# EasyEDA schematic weather_station_project.json
TITLE: Sheet_1; REV: 1.0; Date: 2025-05-27; Sheet: 1/1; Company: Corentin VERNET
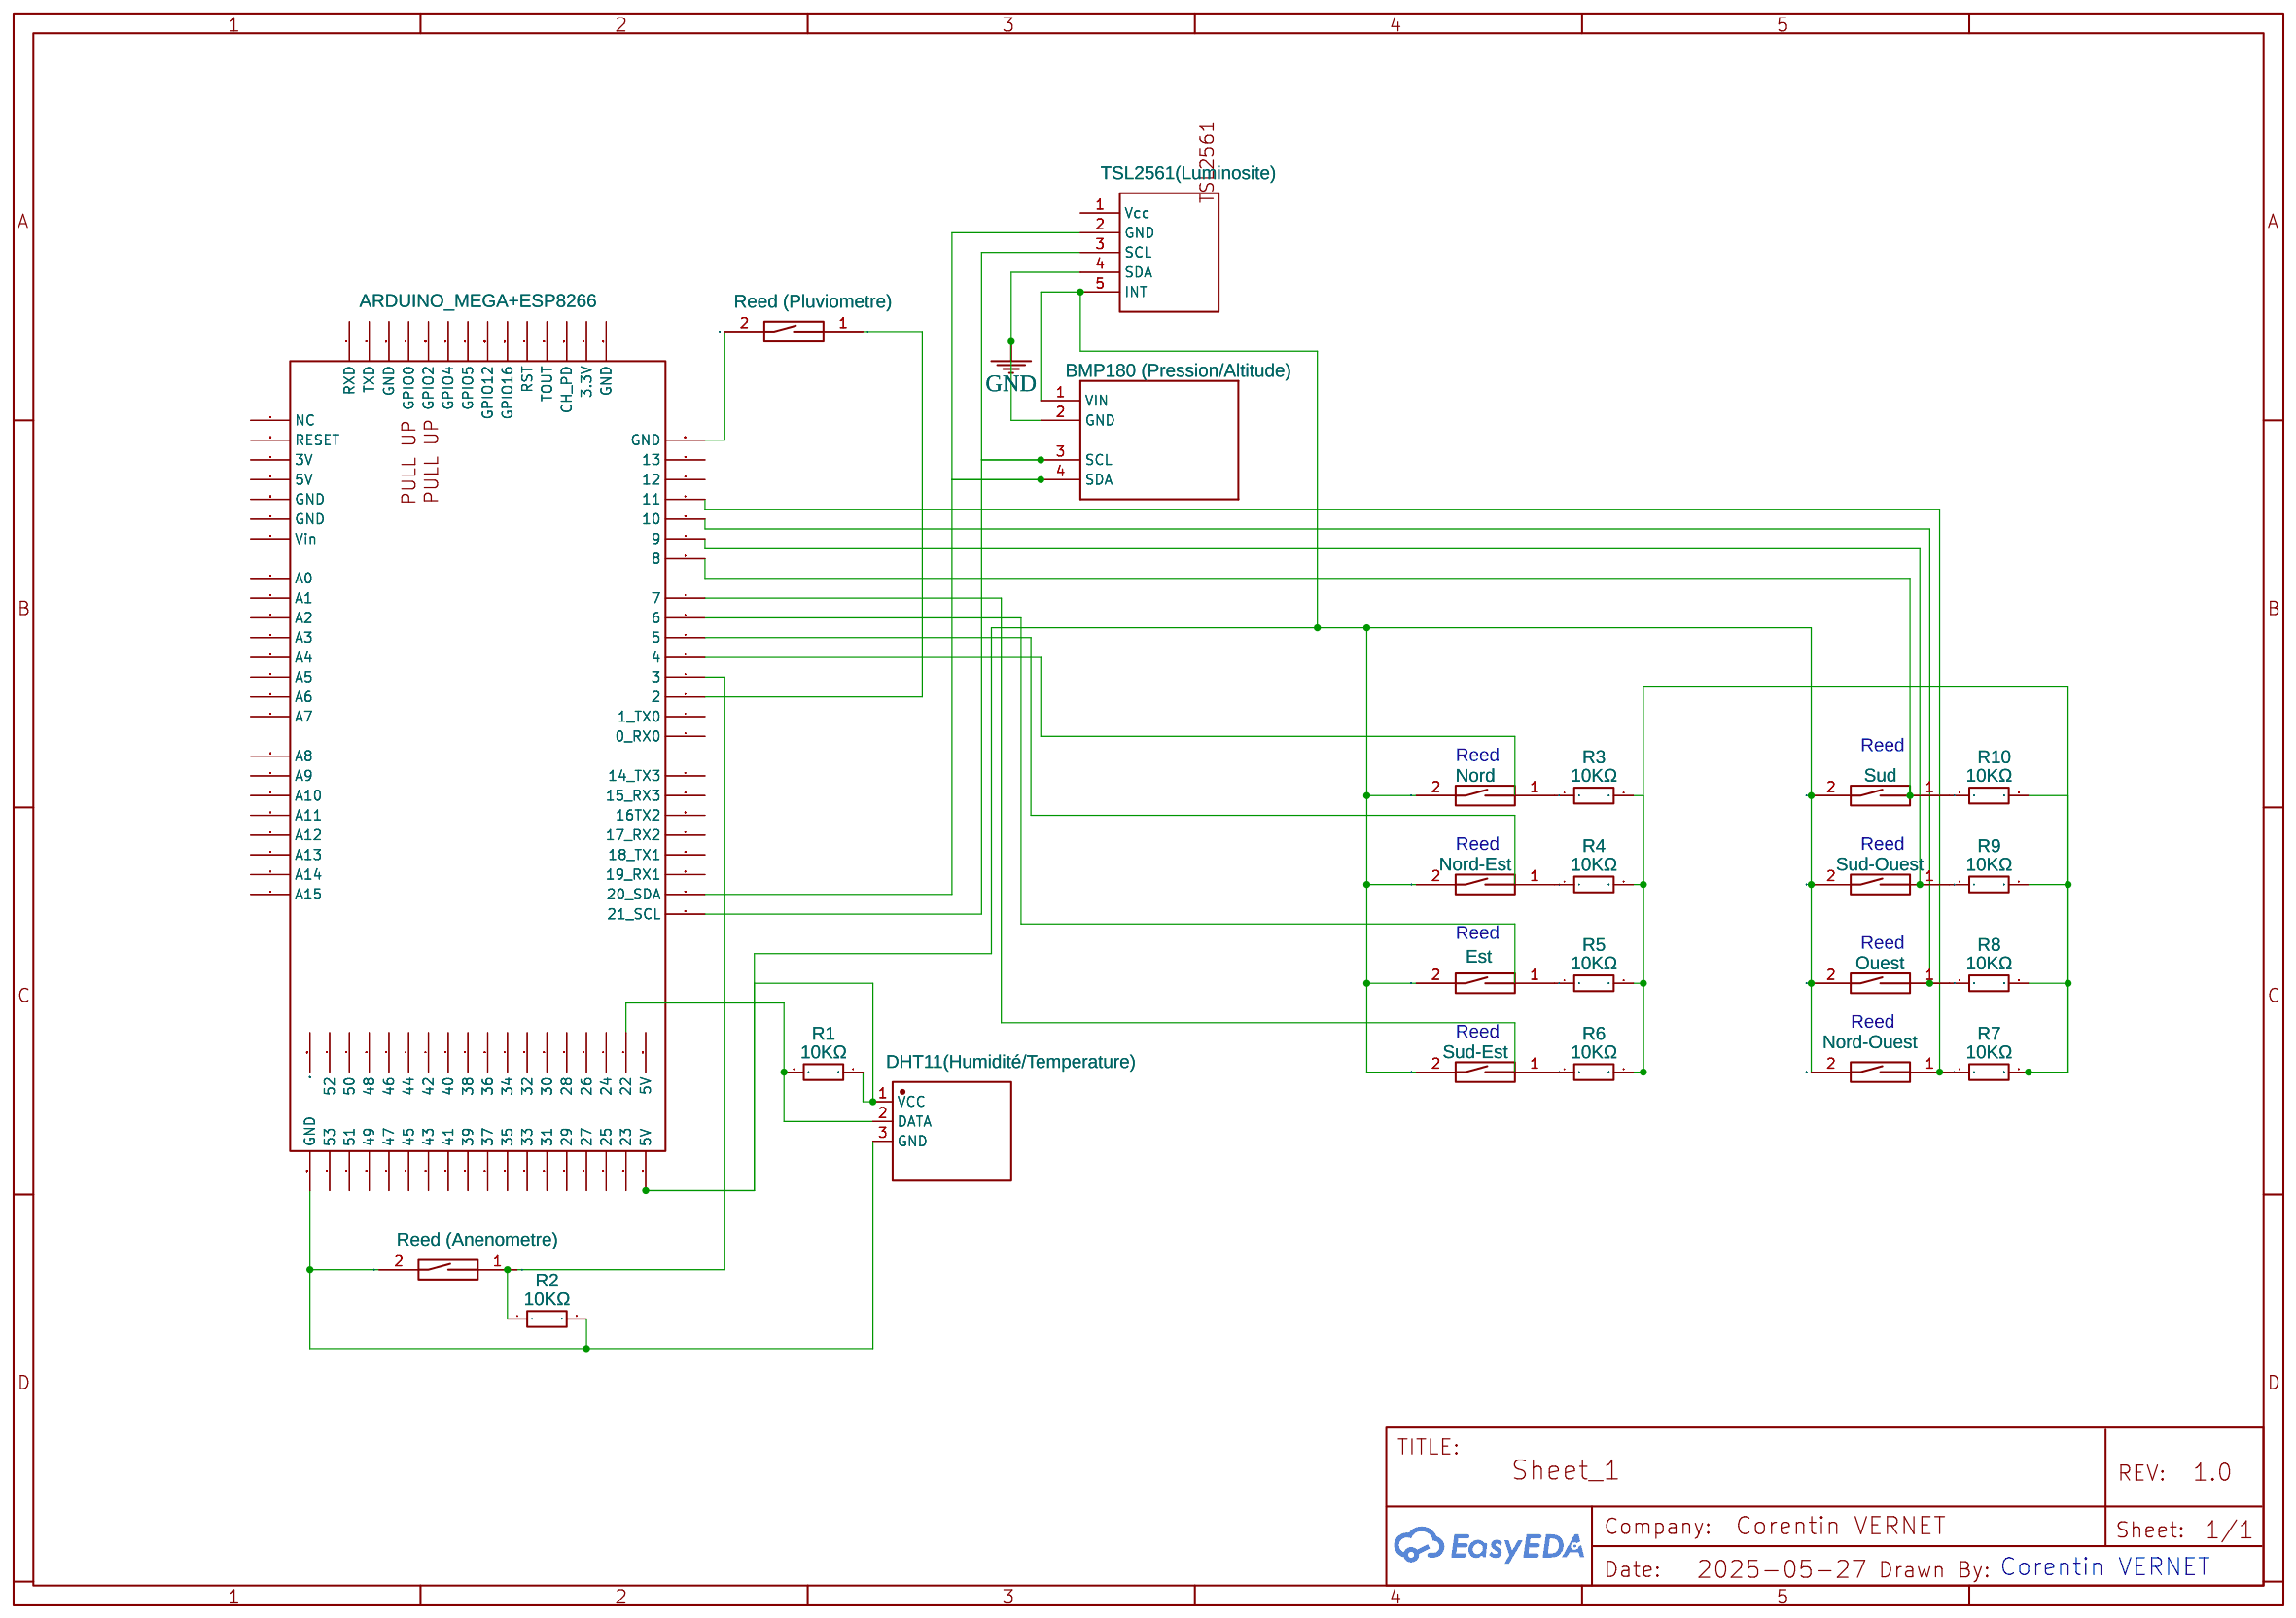
[diagram p0: schematic sheet]

## Parts
M1  TSL2561(Luminosite)  [TSL2561]
R1  10KΩ  [RESISTANCE 10K]
R2  10KΩ  [RESISTANCE 10K]
R3  10KΩ  [RESISTANCE 10K]
R4  10KΩ  [RESISTANCE 10K]
R5  10KΩ  [RESISTANCE 10K]
R6  10KΩ  [RESISTANCE 10K]
R7  10KΩ  [RESISTANCE 10K]
R8  10KΩ  [RESISTANCE 10K]
R9  10KΩ  [RESISTANCE 10K]
R10  10KΩ  [RESISTANCE 10K]
REED  Nord  [REED]
S1  Reed (Pluviometre)  [REED]
S2  Reed (Anenometre)  [REED]
S3  Sud-Est  [REED]
S4  Sud  [REED]
S5  Est  [REED]
S6  Sud-Ouest  [REED]
S7  Ouest  [REED]
S8  Nord-Est  [REED]
S9  Nord-Ouest  [REED]
U1  BMP180 (Pression/Altitude)  [BMP180]
U2  ARDUINO_MEGA+ESP8266  [ARDUINO_MEGA+ESP8266_PCB_WHOLES]
U3  DHT11(Humidité/Temperature)  [DIP-DHT11]  (section 1)

## Library data of the parts
M1 = TSL2561: sourceId: vBbLlUSQ2; Contributor: cyrille52
R1-R10 = Resistance 10k: Supplier: LCSC; Supplier Part: C123392; Manufacturer: Nanjing Shiheng Elec; Manufacturer Part: MF58 103J3470; Contributor: taha.satoglu; JLCPCB Part Class: Extended Part
REED S1-S9 = Reedswitch: Contributor: Jvesga29
U1 = BMP180: Contributor: Maria Nastase
U2 = ARDUINO_MEGA+ESP8266: Manufacturer Part: ARDUINO MEGA; Contributor: cyrillicsoft; subpart_no: 1; link: http://https://www.adafruit.com/product/382; Manufacturer: za
U3 = DIP-DHT11: Supplier: LCSC; Manufacturer: AOSONG; Manufacturer Part: DHT11; Contributor: nikhishin0221; Supplier Part: C117051; subpart_no: 1

## Nets
GND: M1.4(SDA) U1.2(GND)
Net-(M1-2): M1.2(GND) U1.4(SDA) U2.20(20 SDA)
Net-(M1-3): M1.3(SCL) U1.3(SCL) U2.21(21 SCL)
Net-(M1-5): M1.5(INT) R1.2 REED.2 S3.2 S4.2 S5.2 S6.2 S7.2 S8.2 S9.2 U1.1(VIN) U2.5V_2(5V) U3.1(VCC)
Net-(R1-1): R1.1 U2.22 U3.2(DATA)
Net-(R2-1): R2.1 S2.1 U2.3
Net-(R2-2): R2.2 S2.2 U2.GND_2(GND) U3.3(GND)
Net-(R3-2): R3.2 R4.2 R5.2 R6.2 R7.2 R8.2 R9.2 R10.2
Net-(R7-1): R7.1 S9.1 U2.11
Net-(R8-1): R8.1 S7.1 U2.10
Net-(R9-1): R9.1 S6.1 U2.9
Net-(R10-1): R10.1 S4.1 U2.8
Net-(REED-1): REED.1 U2.4
Net-(S1-1): S1.1 U2.2
Net-(S1-2): S1.2 U2.GND_4(GND)
Net-(S3-1): S3.1 U2.7
Net-(S5-1): S5.1 U2.6
Net-(S8-1): S8.1 U2.5

Not connected (* = marked no-connect by the designer): M1 1(Vcc); R3 1; R4 1; R5 1; R6 1; U2 0(0 RX0) 1(1 TX0) 3.3V 3V 5V 5V_1(5V) 12 13 14(14 TX3) 15(15 RX3) 16(16TX2) 17(17 RX2) 18(18 TX1) 19(19 RX1) 23 24 25 26 27 28 29 30 31 32 33 34 35 36 37 38 39 40 41 42 43 44 45 46 47 48 49 50 51 52 53 A0 A1 A2 A3 A4 A5 A6 A7 A8 A9 A10 A11 A12 A13 A14 A15 CH_PD GND GND_1(GND) GND_3(GND) GND_6(GND) GND_7(GND) GPIO0 GPIO2 GPIO4 GPIO5 GPIO12 GPIO16 NC RESET RST RXD TOUT TXD Vin

## Notes on the sheet
- Reed
- Reed
- Reed
- Reed
- Reed
- Reed
- Reed
- Reed
- Corentin VERNET
